# EAGLE design smt (EAGLE 7.7.0)
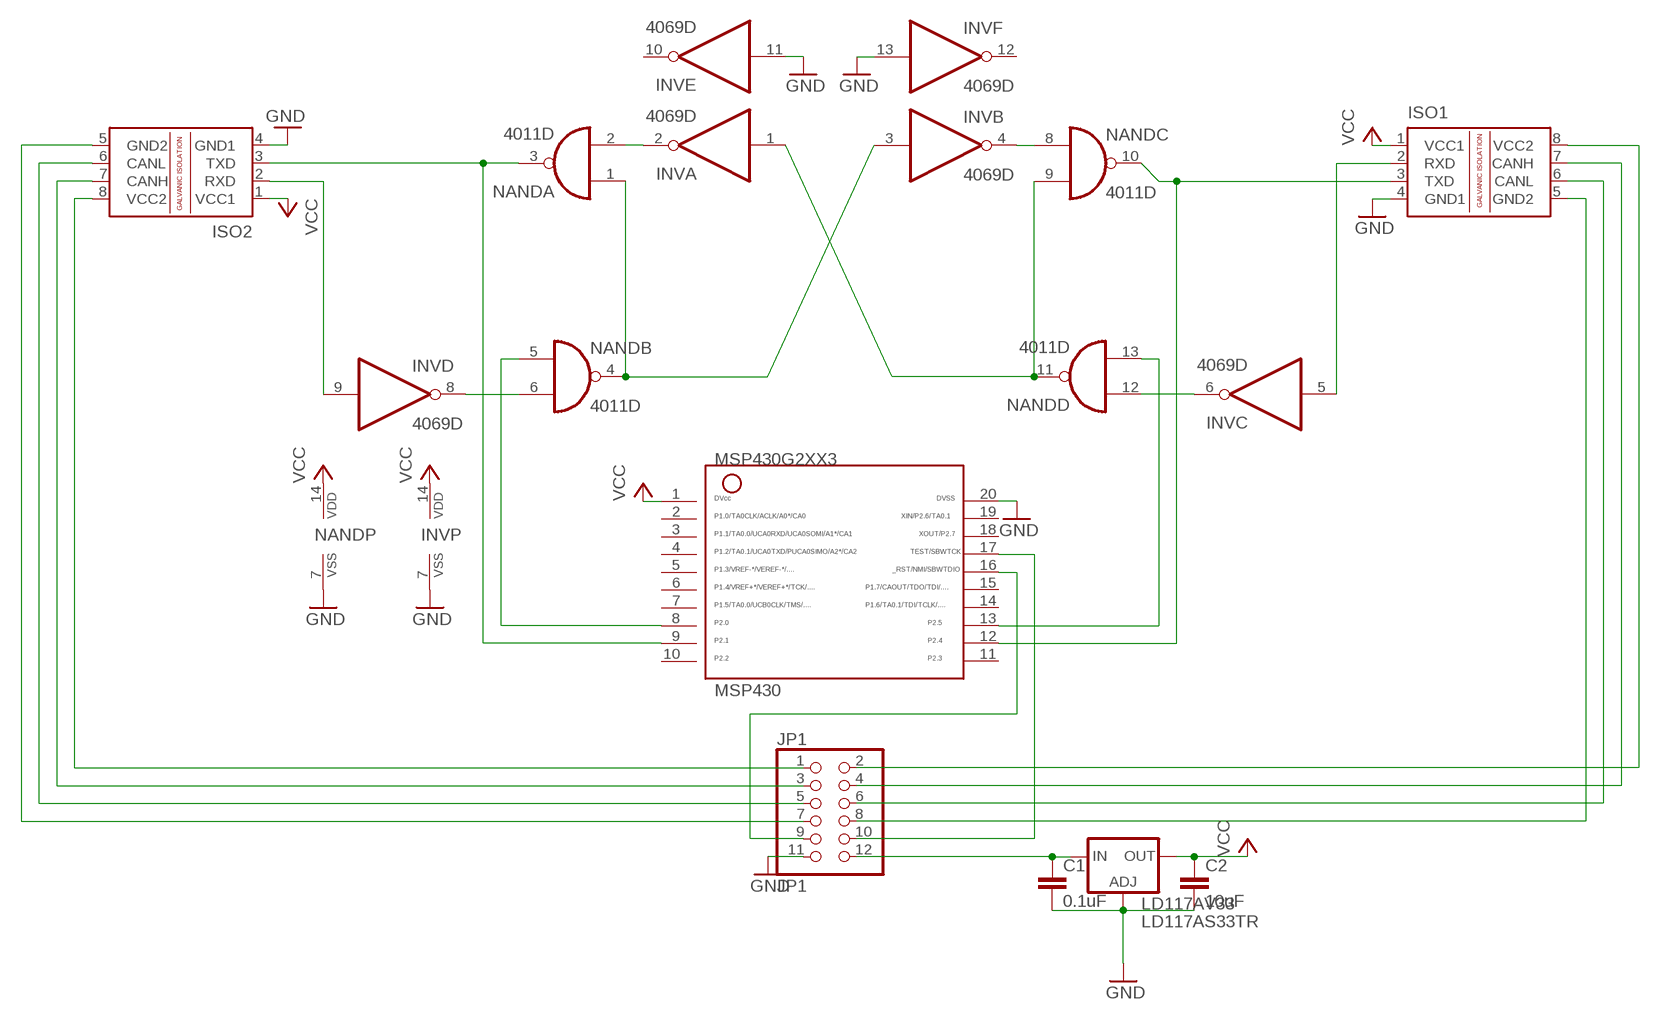
[diagram p0: schematic, sheet 1]

## Parts
C1  0.1uF  C-EUC0402  [C0402]
C2  10uF  C-EUC0402  [C0402]
INV  4069D  [SO14]
ISO1  ISO1050DUB  [DUB-R-PDSO-G8]
ISO2  ISO1050DUB  [DUB-R-PDSO-G8]
JP1  JP1  PINHD-2X6  [2X06]
LD117AV33  LD117AS33TR  [SOT223]
MSP430  G2XX3---PW20  [PW20]
NAND  4011D  [SO14]

## Nets
GND: C1.2 C2.2 INV.7(P:VSS) INV.11(E:I) INV.13(F:I) ISO1.4(GND1) ISO2.4(GND1) JP1.11 LD117AV33.1(ADJ) MSP430.20 NAND.7(P:VSS)
N$1: JP1.9 MSP430.16
N$2: JP1.10 MSP430.17
N$3: INV.8(D:O) NAND.6(B:I1)
N$4: INV.2(A:O) NAND.2(A:I1)
N$5: INV.4(B:O) NAND.8(C:I0)
N$6: INV.6(C:O) NAND.12(D:I0)
N$7: INV.1(A:I) NAND.9(C:I1) NAND.11(D:O)
N$8: INV.3(B:I) NAND.1(A:I0) NAND.4(B:O)
N$9: ISO2.8(VCC2) JP1.1
N$10: ISO2.7(CANH) JP1.3
N$11: ISO2.6(CANL) JP1.5
N$12: ISO2.5(GND2) JP1.7
N$13: ISO1.8(VCC2) JP1.2
N$14: ISO1.7(CANH) JP1.4
N$15: ISO1.6(CANL) JP1.6
N$16: ISO1.5(GND2) JP1.8
N$18: INV.5(C:I) ISO1.2(RXD)
N$20: INV.9(D:I) ISO2.2(RXD)
N$21: MSP430.8 NAND.5(B:I0)
N$22: MSP430.13 NAND.13(D:I1)
N$23: C1.1 JP1.12 LD117AV33.3(IN)
N$24: ISO2.3(TXD) MSP430.9 NAND.3(A:O)
N$25: ISO1.3(TXD) MSP430.12 NAND.10(C:O)
VCC: C2.1 INV.14(P:VDD) ISO1.1(VCC1) ISO2.1(VCC1) LD117AV33.4(OUT) MSP430.1 NAND.14(P:VDD)
Unconnected: INV.10(E:O) INV.12(F:O) MSP430.2 MSP430.3 MSP430.4 MSP430.5 MSP430.6 MSP430.7 MSP430.10 MSP430.11 MSP430.14 MSP430.15 MSP430.18 MSP430.19

## Library data of the parts
C1 C2 = rcl:C-EU: CAPACITOR, European symbol
INV = 40xx:4069: Hex INVERTER
ISO1 ISO2 = texas:ISO1050: ISOLATED CAN TRANSCEIVER Source: http://focus.ti.com/lit/ds/symlink/iso1050.pdf; MPN: ISO1050DUBR; OC_FARNELL: 1755712; OC_NEWARK: 14R9899
JP1 = pinhead:PINHD-2X6: PIN HEADER
LD117AV33 = v-reg:LD117A?*: Low drop fixed and adjustable positive voltage regulators 1 A Source: http://www.st.com/stonline/products/literature/ds/7194/ld1117axx.pdf
MSP430 = TI_MSP430_v16:G2XX3---PW20: MSP430G2XX1 TSSOP (PW) 20 Pin Package
NAND = 40xx:4011: Quad 2-input NAND

## Board
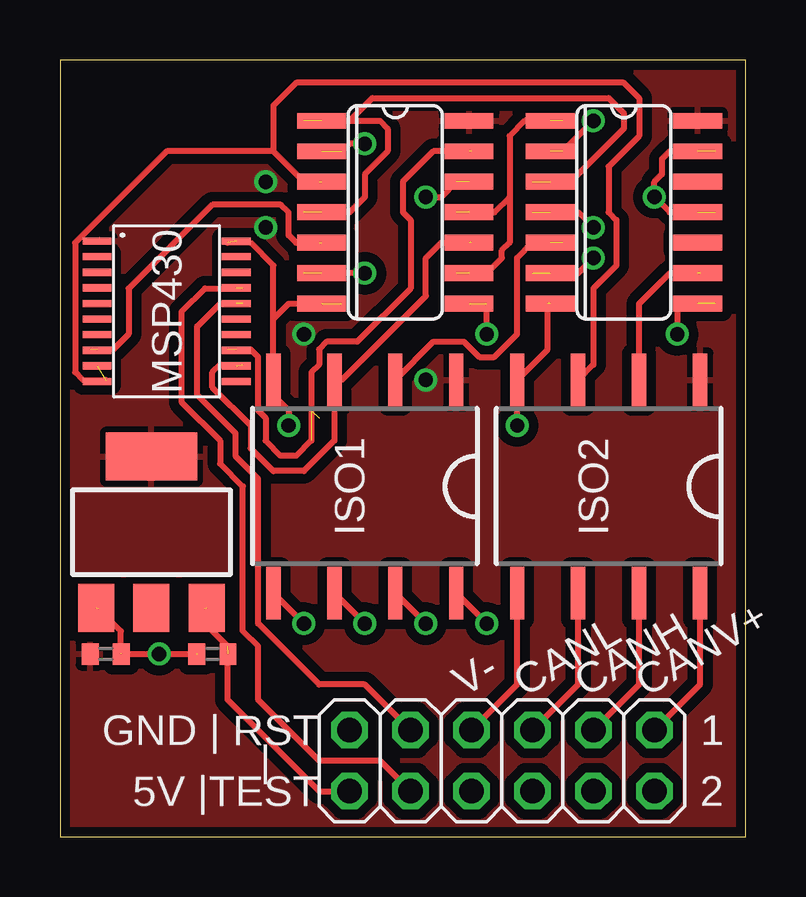
[diagram p1: board, top side]
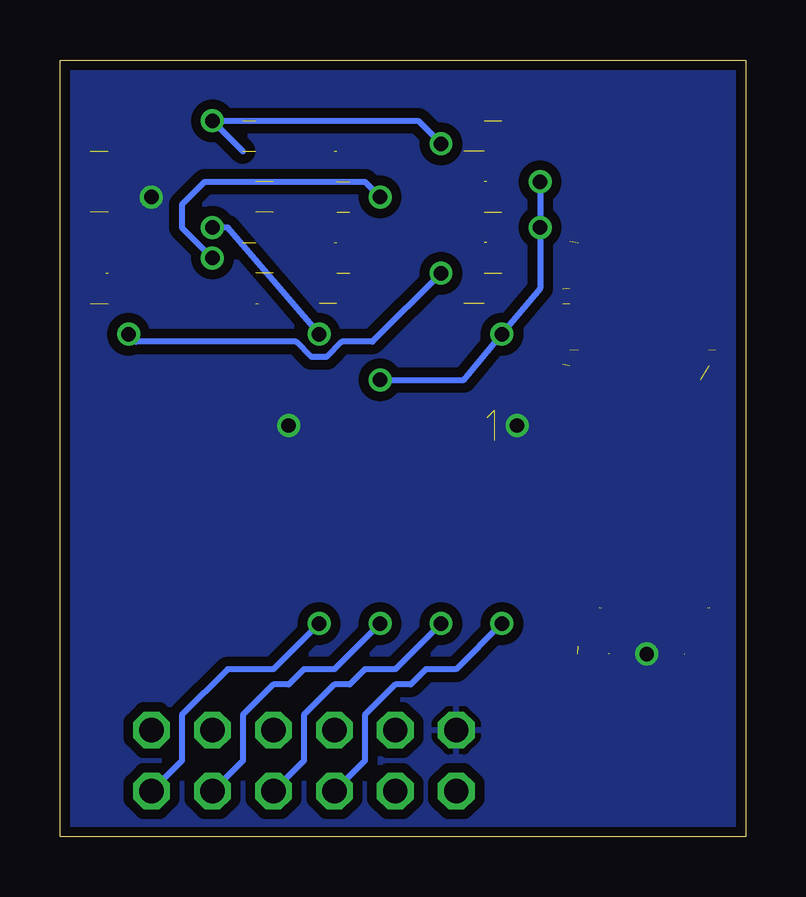
[diagram p2: board, bottom side, seen from below]

Size 28.57 x 32.38 mm. Coordinates in mm from the lower left corner, seen from the top.
Outline: 0,0 28.57,0 28.57,32.38 0,32.38 0,0
Copper layers (1*16): Top 0.0356mm / dielectric 1.5011mm / Bottom 0.0356mm
Design rules "oshpark-2layer": minimum track width 6mil, minimum drill 13mil, track to track 6mil, track to pad 6mil, pad to pad 6mil, via to via 6mil, smd to smd 6mil, copper to edge 15mil, drill to drill 6mil, minimum pad ring 7mil, minimum via ring 7mil, stop-mask expansion 2.5mil, vias tented up to drill 0mil, thermal gap 10mil

### Footprints (pad centres in the part's own frame; a part is rotated, then mirrored left to right if it is on the bottom)
C0402 = smd 0.7 x 0.9: 1 -0.65,0; 2 0.65,0
SO14 = smd 0.66 x 2.032: 1 -3.81,-3.073; 2 -2.54,-3.073; 3 -1.27,-3.073; 4 0,-3.073; 5 1.27,-3.073; 6 2.54,-3.073; 7 3.81,-3.073; 8 3.81,3.073; 9 2.54,3.073; 10 1.27,3.073; 11 0,3.073; 12 -1.27,3.073; 13 -2.54,3.073; 14 -3.81,3.073
DUB-R-PDSO-G8 = smd 0.6 x 2.2: 1 -3.81,-4.445; 2 -1.27,-4.445; 3 1.27,-4.445; 4 3.81,-4.445; 5 3.81,4.445; 6 1.27,4.445; 7 -1.27,4.445; 8 -3.81,4.445
2X06 = drill 1.016 octagon: 1 -6.35,-1.27; 2 -6.35,1.27; 3 -3.81,-1.27; 4 -3.81,1.27; 5 -1.27,-1.27; 6 -1.27,1.27; 7 1.27,-1.27; 8 1.27,1.27; 9 3.81,-1.27; 10 3.81,1.27; 11 6.35,-1.27; 12 6.35,1.27
SOT223 = smd 1.5 x 2: 1 -2.3,-3.15; 2 0,-3.15; 3 2.3,-3.15 | smd 3.8 x 2: 4 0,3.15
PW20 = smd 0.3 x 1.2: 1 -2.925,-2.9; 2 -2.275,-2.9; 3 -1.625,-2.9; 4 -0.975,-2.9; 5 -0.325,-2.9; 6 0.325,-2.9; 7 0.975,-2.9; 8 1.625,-2.9; 9 2.275,-2.9; 10 2.925,-2.9; 11 2.925,2.9; 12 2.275,2.9; 13 1.625,2.9; 14 0.975,2.9; 15 0.325,2.9; 16 -0.325,2.9; 17 -0.975,2.9; 18 -1.625,2.9; 19 -2.275,2.9; 20 -2.925,2.9

### Placement (x,y rotation side)
C1  6.35,7.62 180 top
C2  1.91,7.62 0 top
INV  23.5,26.04 270 top
ISO1  12.7,14.61 180 top
ISO2  22.86,14.61 180 top
JP1  18.41,3.17 180 top
LD117AV33  3.81,12.7 0 top
MSP430  4.45,21.91 270 top
NAND  13.97,26.04 270 top

### Tracks (layer width: path | path; a pad name or v marks a point on that pad's centre or on a via)
GND  (via drill 0.6)  (8 unrouted)
  Top 0.254: 20.32,22.23 20.32,20.32 ISO2.4 v19.05,17.14 | 5.71,7.62 v4.13,7.62 2.54,7.62 2.54,8.57 1.59,9.53 | v9.53,17.14 9.53,17.78 8.89,18.41 ISO1.4 8.89,21.59 | 27.3,28.57 25.4,28.57 25.08,28.26 25.08,27.62 24.77,27.3 v24.77,26.67 25.4,26.04 27.3,26.04 | 8.89,21.59 9.53,22.23 11.75,22.23 | 8.89,21.59 8.89,23.81 7.94,24.77 6.99,24.77
  pour Bottom (isolate 0.406): 0,0 0,32.38 28.57,32.38 28.57,0
N$1  (1 unrouted)
  Top 0.254: JP1.9 12.7,6.35 10.79,6.35 8.26,8.89 8.26,14.92 7.3,15.88 7.3,16.83 5.71,18.41 5.71,21.27 6.67,22.23 7.62,22.23
N$2  (1 unrouted)
  Top 0.254: JP1.10 13.34,3.17 10.79,3.17 8.26,5.71 8.26,7.94 7.62,8.57 7.62,14.61 6.67,15.56 6.67,16.51 5.08,18.1 5.08,21.91 6.03,22.86 7.62,22.86
N$3  (via drill 0.6)  (2 unrouted)
  Top 0.254: v12.7,23.5 10.16,23.5 | v25.72,20.95 25.72,22.23 27.3,22.23
  Bottom 0.254: v12.7,23.5 15.56,20.64 16.83,20.64 17.46,20 18.1,20 18.73,20.64 25.4,20.64 v25.72,20.95
N$4  (via drill 0.6)  (2 unrouted)
  Top 0.254: v22.23,29.84 20.95,28.57 19.68,28.57 | v12.7,28.89 12.06,28.89 11.75,28.57
  Bottom 0.254: 20.95,28.57 v22.23,29.84 13.65,29.84 v12.7,28.89
N$5  (via drill 0.6)  (2 unrouted)
  Top 0.254: v22.23,25.4 21.59,26.04 19.68,26.04 | v17.78,20.95 17.78,22.23 16.19,22.23
  Bottom 0.254: v17.78,20.95 21.59,25.4 v22.23,25.4
N$6  (via drill 0.6)  (2 unrouted)
  Top 0.254: v15.24,26.67 15.88,26.67 16.51,27.3 | v22.23,24.13 21.59,23.5 19.68,23.5
  Bottom 0.254: v22.23,24.13 23.5,25.4 23.5,26.35 22.54,27.3 15.88,27.3 v15.24,26.67
N$7  (3 unrouted)
  Top 0.254: 20.95,29.84 19.37,29.84 18.73,29.21 18.73,26.67 | 18.73,26.67 18.1,26.04 16.51,26.04 | 18.73,26.67 18.73,24.77 18.41,24.45 18.41,24.13 17.78,23.5 16.51,23.5
N$8  (3 unrouted)
  Top 0.254: 10.16,26.04 12.06,26.04 12.7,26.67 12.7,27.62 13.65,28.57 13.65,29.53 13.34,29.84 12.06,29.84 | 10.16,29.84 12.06,29.84 | 12.06,29.84 13.02,30.8 22.86,30.8 23.5,30.16 23.5,29.53 21.27,27.3 19.68,27.3
N$9
  Top 0.254: JP1.1 26.67,6.35 ISO2.8
N$10
  Top 0.254: JP1.3 24.13,6.35 ISO2.7
N$11
  Top 0.254: JP1.5 21.59,6.35 ISO2.6
N$12
  Top 0.254: JP1.7 19.05,6.35 ISO2.5
N$13  (via drill 0.6)
  Top 0.254: ISO1.8 v17.78,8.89
  Bottom 0.254: v17.78,8.89 19.68,6.99 21.59,6.99 23.5,5.08 23.5,3.17 JP1.2
N$14  (via drill 0.6)
  Top 0.254: ISO1.7 v15.24,8.89
  Bottom 0.254: v15.24,8.89 17.14,6.99 18.41,6.99 19.05,6.35 19.68,6.35 20.95,5.08 20.95,3.17 JP1.4
N$15  (via drill 0.6)
  Top 0.254: ISO1.6 v12.7,8.89
  Bottom 0.254: v12.7,8.89 14.61,6.99 15.88,6.99 16.51,6.35 17.14,6.35 18.41,5.08 18.41,3.17 JP1.6
N$16  (via drill 0.6)
  Top 0.254: ISO1.5 v10.16,8.89
  Bottom 0.254: v10.16,8.89 12.06,6.99 13.34,6.99 13.97,6.35 14.61,6.35 15.88,5.08 15.88,3.17 JP1.8
N$18  (1 unrouted)
  Top 0.254: ISO1.2 15.56,20.64 16.83,20.64 17.46,20 18.1,20 19.05,20.95 19.05,24.13 19.68,24.77 20.95,24.77
N$20  (1 unrouted)
  Top 0.254: 26.67,23.5 25.4,23.5 24.13,22.23 ISO2.2
N$21  (2 unrouted)
  Top 0.254: 10.79,24.77 9.84,24.77 9.53,25.08 9.53,26.04 9.21,26.35 6.35,26.35 2.86,22.86 2.86,20.95 2.22,20.32 1.27,20.32
N$22  (4 unrouted)
  Top 0.254: 17.14,28.57 15.56,28.57 14.29,27.3 14.29,26.04 14.61,25.72 14.61,22.86 12.38,20.64 11.11,20.64 10.79,20.32 10.79,19.68 10.48,19.37 10.48,16.51 9.84,15.88 9.21,15.88 8.57,16.51 8.57,17.46 8.26,17.78 8.26,20 7.94,20.32 6.99,20.32
N$23  (2 unrouted)
  Top 0.254: JP1.12 10.79,1.91 6.99,5.71 6.99,7.94 6.03,8.89 6.03,9.53
N$24  (2 unrouted)
  Top 0.254: 8.89,28.57 8.89,30.48 9.84,31.43 23.5,31.43 24.13,30.8 24.13,29.21 22.86,27.94 22.86,26.04 23.18,25.72 23.18,23.81 22.23,22.86 22.23,19.68 ISO2.3 | 8.89,28.57 10.16,27.3 10.79,27.3 | 8.89,28.57 4.45,28.57 0.64,24.77 0.64,19.37 0.95,19.05 1.91,19.05
N$25  (2 unrouted)
  Top 0.254: 17.14,24.77 15.88,24.77 15.24,24.13 15.24,22.54 11.75,19.05 ISO1.3 11.43,16.51 10.16,15.24 8.89,15.24 7.94,16.19 7.94,17.14 6.35,18.73 6.35,19.37 6.67,19.68 7.62,19.68
VCC  (via drill 0.6)
  Bottom 0.254: v15.24,19.05 11.75,19.05 v10.16,20.95 8.57,22.86 v8.57,25.4 v8.57,27.3
  pour Top (isolate 0.406): 0,0 0,32.38 28.57,32.38 28.57,0

### Text on the board
tPlace: ISO1 | ISO2 | V- | CANL | CANH | CANV+ | GND | RST | 1 | | | 5V |TEST | 2